# Altium schematic sheet CONN.SchDoc
size B; SheetNumber: 4; SheetTotal: 5
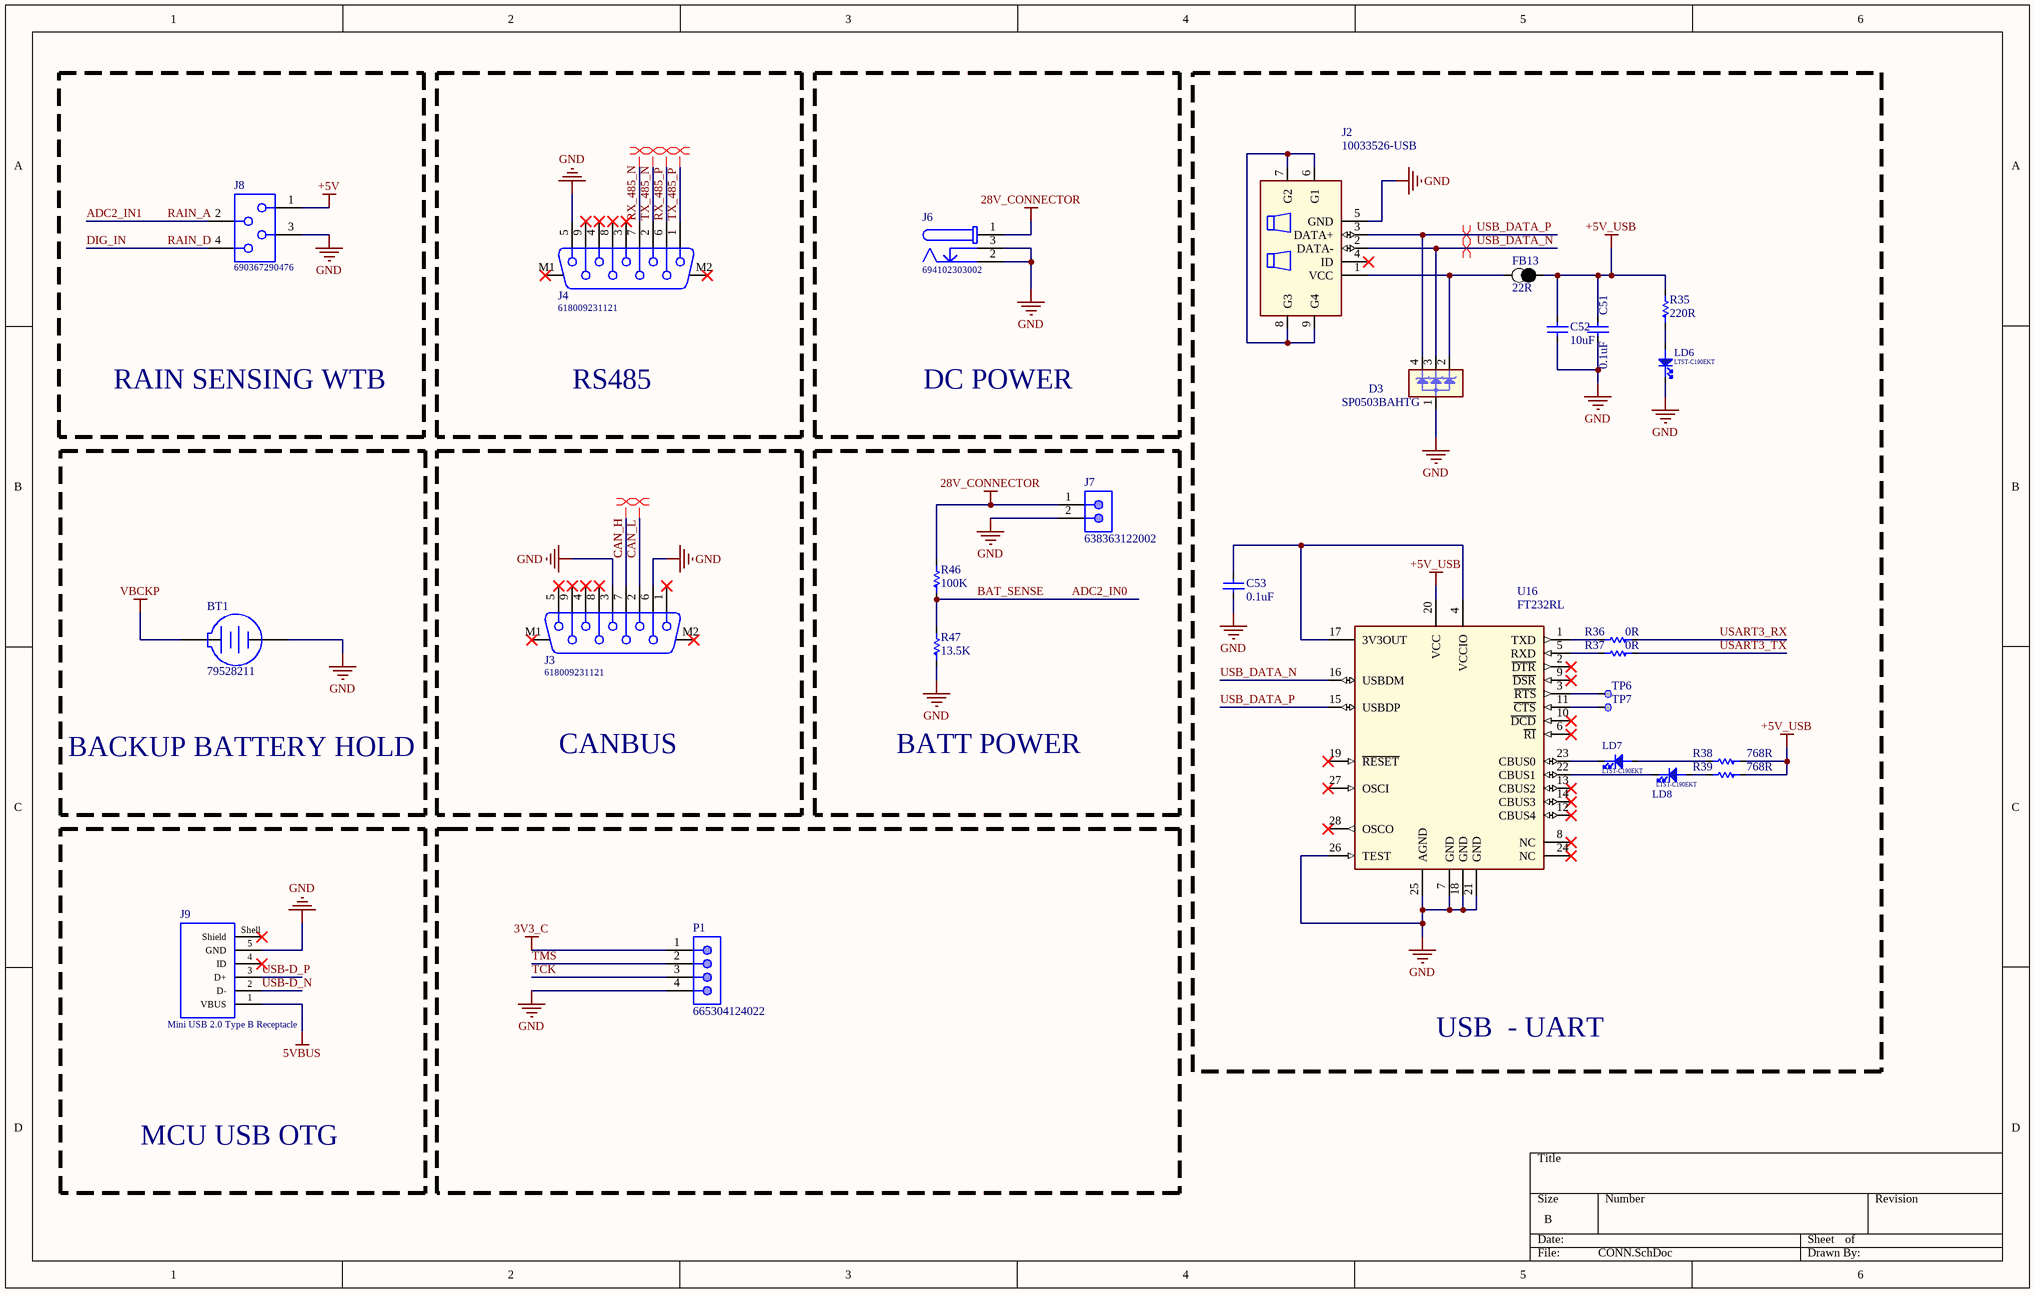
[diagram p0: CONN.SchDoc]

## Parts
BT1  79528211  [79528211]
C51  0.1uF  [CAPC1608-0603X85N]
C52  10uF  [CAPC3216-1206X100N]
C53  0.1uF  [CAPC1608-0603X85N]
D3  SP0503BAHTG  [SOT143N]
FB13  22R  [INDC2012-0805X90N]
J2  10033526-USB  [USB/SM0.8-6H5]
J3  618009231121  [618009231121]
J4  618009231121  [618009231121]
J6  694102303002  [694102303002]
J7  638363122002  [638363122002]
J8  690367290476  [690367290476]
J9  Mini USB 2.0 Type B Receptacle  [614105150721]
LD6  LTST-C190EKT  [LED0603-1608X55N-RED]
LD7  LTST-C190EKT  [LED0603-1608X55N-RED]
LD8  LTST-C190EKT  [LED0603-1608X55N-RED]
P1  665304124022  [665304124022]
R35  220R  [RESC1608-0603X50N]
R36  0R  [RESC1608-0603X50N]
R37  0R  [RESC1608-0603X50N]
R38  768R  [RESC2012-0805X50N]
R39  768R  [RESC2012-0805X50N]
R46  100K  [RESC1608-0603X50N]
R47  13.5K  [RESC1608-0603X50N]
TP6  TP  [TP-ROUND]  (value not drawn)  (no BOM)
TP7  TP  [TP-ROUND]  (value not drawn)  (no BOM)
U16  FT232RL  [SSOP65P790-28N]

## Blocks framed on the sheet
RAIN SENSING WTB: J8
RS485: J4
DC POWER: J6
USB  - UART: C51-C53 D3 FB13 J2 LD6-LD8 R35-R39 TP6 TP7 U16
BACKUP BATTERY HOLD: BT1
CANBUS: J3
BATT POWER: J7 R46 R47
MCU USB OTG: J9

## Nets
3V3_C: P1.1
5VBUS: J9.1(VBUS)
28V_CONNECTOR: J6.1 J7.1 R46.2
+5V: J8.1
+5V_USB: C51.1 C52.2 FB13.1 R35.2 R38.1 R39.1 U16.20(VCC)
GND: BT1.2(-) C51.2 C52.1 C53.2 D3.1(A) J2.5(GND) J3.3 J3.6 J4.5 J6.2 J6.3 J7.2 J8.3 J9.5(GND) LD6.2 P1.4 R47.1 U16.7(GND) U16.18(GND) U16.21(GND) U16.25(AGND) U16.26(TEST)
VBCKP: BT1.1(+)
ADC2_IN0: R46.1 R47.2  [also labelled BAT_SENSE]
ADC2_IN1: J8.2  [also labelled RAIN_A]
CAN_H: J3.7
CAN_L: J3.2
DIG_IN: J8.4  [also labelled RAIN_D]
RX_485_N: J4.7
RX_485_P: J4.6
TCK: P1.3
TMS: P1.2
TX_485_N: J4.2
TX_485_P: J4.1
USART3_RX: R36.1
USART3_TX: R37.1
USB-D_N: J9.2(D-)
USB-D_P: J9.3(D+)
USB_DATA_N: D3.3(C2) J2.2(DATA-) U16.16(USBDM)
USB_DATA_P: D3.4(C1) J2.3(DATA+) U16.15(USBDP)
NetC53_1: C53.1 U16.4(VCCIO) U16.17(3V3OUT)
NetD3_2: D3.2(C3) FB13.2 J2.1(VCC)
NetJ2_6: J2.6(G1) J2.7(G2) J2.8(G3) J2.9(G4)
NetLD6_1: LD6.1 R35.1
NetLD7_1: LD7.1 R38.2
NetLD7_2: LD7.2 U16.23(CBUS0)
NetLD8_1: LD8.1 R39.2
NetLD8_2: LD8.2 U16.22(CBUS1)
NetR36_2: R36.2 U16.1(TXD)
NetR37_2: R37.2 U16.5(RXD)
NetTP6_1: TP6.1 U16.3(~{RTS})
NetTP7_1: TP7.1 U16.11(~{CTS})

Not connected (* = marked no-connect by the designer): J2 4(ID)*; J3 1* 4* 5* 8* 9* M1* M2*; J4 3* 4* 8* 9* M1* M2*; J9 4(ID)* Shell(Shield)*; U16 2(~{DTR})* 6(~{RI})* 8(NC)* 9(~{DSR})* 10(~{DCD})* 12(CBUS4)* 13(CBUS2)* 14(CBUS3)* 19(~{RESET})* 24(NC)* 27(OSCI)* 28(OSCO)*

## Layout directives
differential pair: CAN_H, CAN_L, RX_485_N, RX_485_P, TX_485_N, TX_485_P, USB_DATA_N, USB_DATA_P

## Library data of the parts
BT1 = 79528211: WA-BCPH Battery Holder, THT, Battery Type 2025/2032; Manufacturer: Wurth Elektronik; ComponentLink1Description: Manufacturer; ComponentLink1URL: http://www.we-online.de; ComponentLink2Description: Datasheet; ComponentLink2URL: https://www.we-online.com/catalog/datasheet/79528211.pdf; Manufacturer Part Number: 79528211; Mounting Technology: THT; Operating Temperature: -40 to +105degC; Battery Type: 2025/2032; Published Date: July 2021; Packaging: Tray
C51 C53 = Capacitor Ceramic: CAP CER 0.1UF 25V X7R 0603; MANUFACTURER PN: CC0603KRX7R8BB104; MANUFACTURER: Yageo; POPULATED: YES; TOLERANCE: ±10%; VOLTAGE: 25V; PACKAGE: 0603; DIGIKEY PN: 311-1341-1-ND
C52 = Capacitor Ceramic: CAP CER 10UF 16V X7R 1206; MANUFACTURER PN: C3216X7R1C106M160AC; MANUFACTURER: TDK Corporation; POPULATED: YES; TOLERANCE: %10; VOLTAGE: 16V; PACKAGE: 1206; DIGIKEY PN: 445-1601-1-ND
D3 = SP0503BAHTG: 30pF 30kV Unidirectional TVS Array, SP05 Series; MANUFACTURER: LittelFuse; POPULATED: YES; VOLTAGE: up to : 30kV; DIGIKEY PN: F2715CT-ND; PRICE: www.littelfuse.com; MANUFACTURER PN: SP0503BAHTG; PACKAGE: SOT143
FB13 = Inductor EMI suppresion: FERRITE BEAD 22 OHM 0805 1LN; MANUFACTURER: Murata; MANUFACTURER PN: BLM21PG220SN1D; POPULATED: YES; VOLTAGE: 0.8A; TOLERANCE: -55°C ~ 125°C; DIGIKEY PN: 490-5987-1-ND; PACKAGE: 0805
J2 = 10033526-USB: CONN MINI USB RCPT RA TYPE B SMD; MANUFACTURER: Amphenol; MANUFACTURER PN: 10033526-N3212LF; POPULATED: YES; TOLERANCE: 1A; VOLTAGE: 30V; DIGIKEY PN: 609-4700-1-ND; PRICE: 0.71
J3 J4 = 618009231121: WR-DSUB 8.08mm Female PCB Connector with Hex Screw, Angled, 9p; Manufacturer: Wurth Elektronik; Pin Number: 9; Rated Current: 3A; Contact Resistance: 30mOhm; Working Voltage: 125VAC; Withstanding Voltage: 1000VAC; ComponentLink1Description: Manufacturer; ComponentLink1URL: http://www.we-online.de; ComponentLink2Description: Datasheet; ComponentLink2URL: https://www.we-online.com/catalog/datasheet/618009231121.pdf; Manufacturer Part Number: 618009231121; Published Date: April 2021; Type: Angled; Operating Temperature: -55 to +105degC; Mounting Technology: THT; Gender: Female; Packaging: Tray
J6 = 694102303002: WR-DC DC Power Jack Connector, Male, Right Angled, 30V, 2A; Manufacturer: Wurth Elektronik; Plug Outer Diameter: 3.5mm; Opening Diameter: 4.2mm; Plug Inner Diameter: 1.05mm; ComponentLink1Description: Manufacturer; ComponentLink1URL: http://www.we-online.de; ComponentLink2Description: Datasheet; ComponentLink2URL: https://www.we-online.com/catalog/datasheet/694102303002.pdf; Orientation: Right Angled; Published Date: March 2021; Manufacturer Part Number: 694102303002; Mounting Technology: THT; Gender: Male; Packaging: Bag; Operating Temperature: -40 to +85degC; Rated Current: 2A; Working Voltage: 30V
J7 = 638363122002: WR-FAST THT Male Header Angled Blade, pitch 7.62mm, 2p; Contact Resistance: 20mOhm; Pin Number: 2; Rated Current: 16A; Working Voltage: 300VAC; ComponentLink1Description: Manufacturer; ComponentLink1URL: http://www.we-online.de; ComponentLink2Description: Datasheet; ComponentLink2URL: https://katalog.we-online.com/em/datasheet/638363122002.pdf; Packaging: Box; Gender: Male; Part Number: 638363122002; Operating Temperature: -30 to +120degC; Publisher: Wurth Elektronik; Published Date: November 2019; Pitch: 7.62mm; Type: Right Angled; Mounting Technology: THT
J8 = 690367290476: WR-MM Mini Module Connector, Female, SMT, with Latch & Polarization, Straight, 4p; Manufacturer: Wurth Elektronik; Pin Number: 4; Pitch: 2.54mm; Insulation Resistance: 1000MOhm; Rated Current: 1.5A; Working Voltage: 250VAC; Withstanding Voltage: 500VAC; Contact Resistance: 10mOhm; ComponentLink1Description: Manufacturer; ComponentLink1URL: http://www.we-online.de; ComponentLink2Description: Datasheet; ComponentLink2URL: https://www.we-online.com/catalog/datasheet/690367290476.pdf; Manufacturer Part Number: 690367290476; Published Date: September 2021; Operating Temperature: -40 to +105degC; Mounting Technology: SMT; Packaging: Tape and Reel; Gender: Female; Type: Straight; Length: 9.68mm
J9 = 614105150721: Mini USB 2.0 Type B, Receptacle, Vertical, THT; Manufacturer: Wurth Elektronik; Rated Current: 1.8A; Pin Number: 5; Interface Type: Type B; Working Voltage: 30VAC; ComponentLink1Description: Manufacturer; ComponentLink1URL: http://www.we-online.de; ComponentLink2Description: Datasheet; ComponentLink2URL: https://katalog.we-online.com/em/datasheet/614105150721.pdf; Published Date: August 2020; Manufacturer Part Number: 614105150721; Gender: Receptacle; Type: Vertical; Packaging: Tape and Reel; Operating Temperature: -40 to +85degC; Mounting Technology: THT; Application: Mini USB 2.0
LD6-LD8 = LED-0603: LED RED CLEAR CHIP SMD; MANUFACTURER: Lite-On Inc; POPULATED: YES; VOLTAGE: 2V; PACKAGE: LED-0603; MANUFACTURER PN: LTST-C190EKT; DIGIKEY PN: 160-1182-1-ND
P1 = 665304124022: WR-WTB SMT Male Vertical Shrouded Header, pitch 1mm, 4p; Pin Number: 4; Contact Resistance: 20mOhm; Rated Current: 1A; Withstanding Voltage: 500VAC; Working Voltage: 50VAC; ComponentLink1Description: Manufacturer; ComponentLink1URL: http://www.we-online.de; ComponentLink2Description: Datasheet; ComponentLink2URL: https://www.we-online.com/catalog/datasheet/665304124022.pdf; Pitch: 1mm; Published Date: January 2020; Publisher: Wurth Elektronik; Mounting Technology: SMT; Packaging: Tape and Reel; Operating Temperature: -25 to +85degC; Part Number: 665304124022; Gender: Male; Type: Vertical
R35 = Resistor SMD: RES SMD 220 OHM 5% 1/10W 0603; MANUFACTURER: Yageo; MANUFACTURER PN: RC0603JR-07220RL; POPULATED: YES; TOLERANCE: %1; DIGIKEY PN: 311-220GRCT-ND; PACKAGE: 0603
R36 R37 = Resistor SMD: RES SMD 0 OHM JUMPER 1/10W 0603; MANUFACTURER: Yageo; MANUFACTURER PN: RC0603JR-070RL; POPULATED: YES; TOLERANCE: ±1%; DIGIKEY PN: 311-0.0GRCT-ND; PACKAGE: 0603
R38 R39 = Resistor SMD: RES SMD 768 OHM 1% 1/8W 0805; MANUFACTURER: YAGEO; MANUFACTURER PN: RC0805FR-07768RL; POPULATED: YES; VOLTAGE: 0.125W, 1/8W; PRICE: 0.1; PACKAGE: 0805; TOLERANCE: ±1%; DIGIKEY PN: 311-768CRCT-ND
R46 R47 = RESISTOR 10K: RES SMD 10K OHM 1% 1/10W 0603; MANUFACTURER: Yageo; MANUFACTURER PN: RC0603FR-0710KL; POPULATED: YES; ANTSIS STOK PN: R10K006030101; ASSEMBLY: Auto; DIGIKEY PN: ANTSIS_STOK; PACKAGE: 0603
TP6 TP7 = TP: Test point; Populated: YES; Assembly Method: Manual
U16 = FT232RL: USB FS SERIAL UART; Manufacturer: FTDI; Tolerance: -40 to +85C; Voltage: +3.3V to +5.25V; Populated: YES; Assembly Method: Auto; Datasheet Link: www.ftdichip.com/Support/Documents/DataSheets/ICs/DS_FT232R.pdf; package Type: SSOP-28; Manufacturer PN: FT232RL; DIGIKEY PN: 768-1306-ND